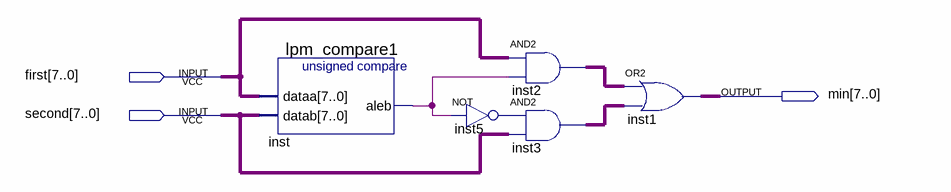
[diagram p0: schematic sheet]
// Quartus schematic GetMin.bdf as structural Verilog: 5 symbols, 3 pins
module GetMin (
  input  [7:0] first,
  input  [7:0] second,
  output [7:0] min
);

  wire inst5_out, inst_aleb;
  wire [7:0] inst2_out, inst3_out;

  lpm_compare1 inst (.dataa(first), .datab(second), .aleb(inst_aleb));
  not inst5 (inst5_out, inst_aleb);
  assign inst2_out = first & {8{inst_aleb}};  // AND2 inst2, 8 bits wide
  assign inst3_out = {8{inst5_out}} & second;  // AND2 inst3, 8 bits wide
  assign min = inst2_out | inst3_out;  // OR2 inst1, 8 bits wide
endmodule
